# Altium schematic sheet EnviroNode.SchDoc
size Tabloid
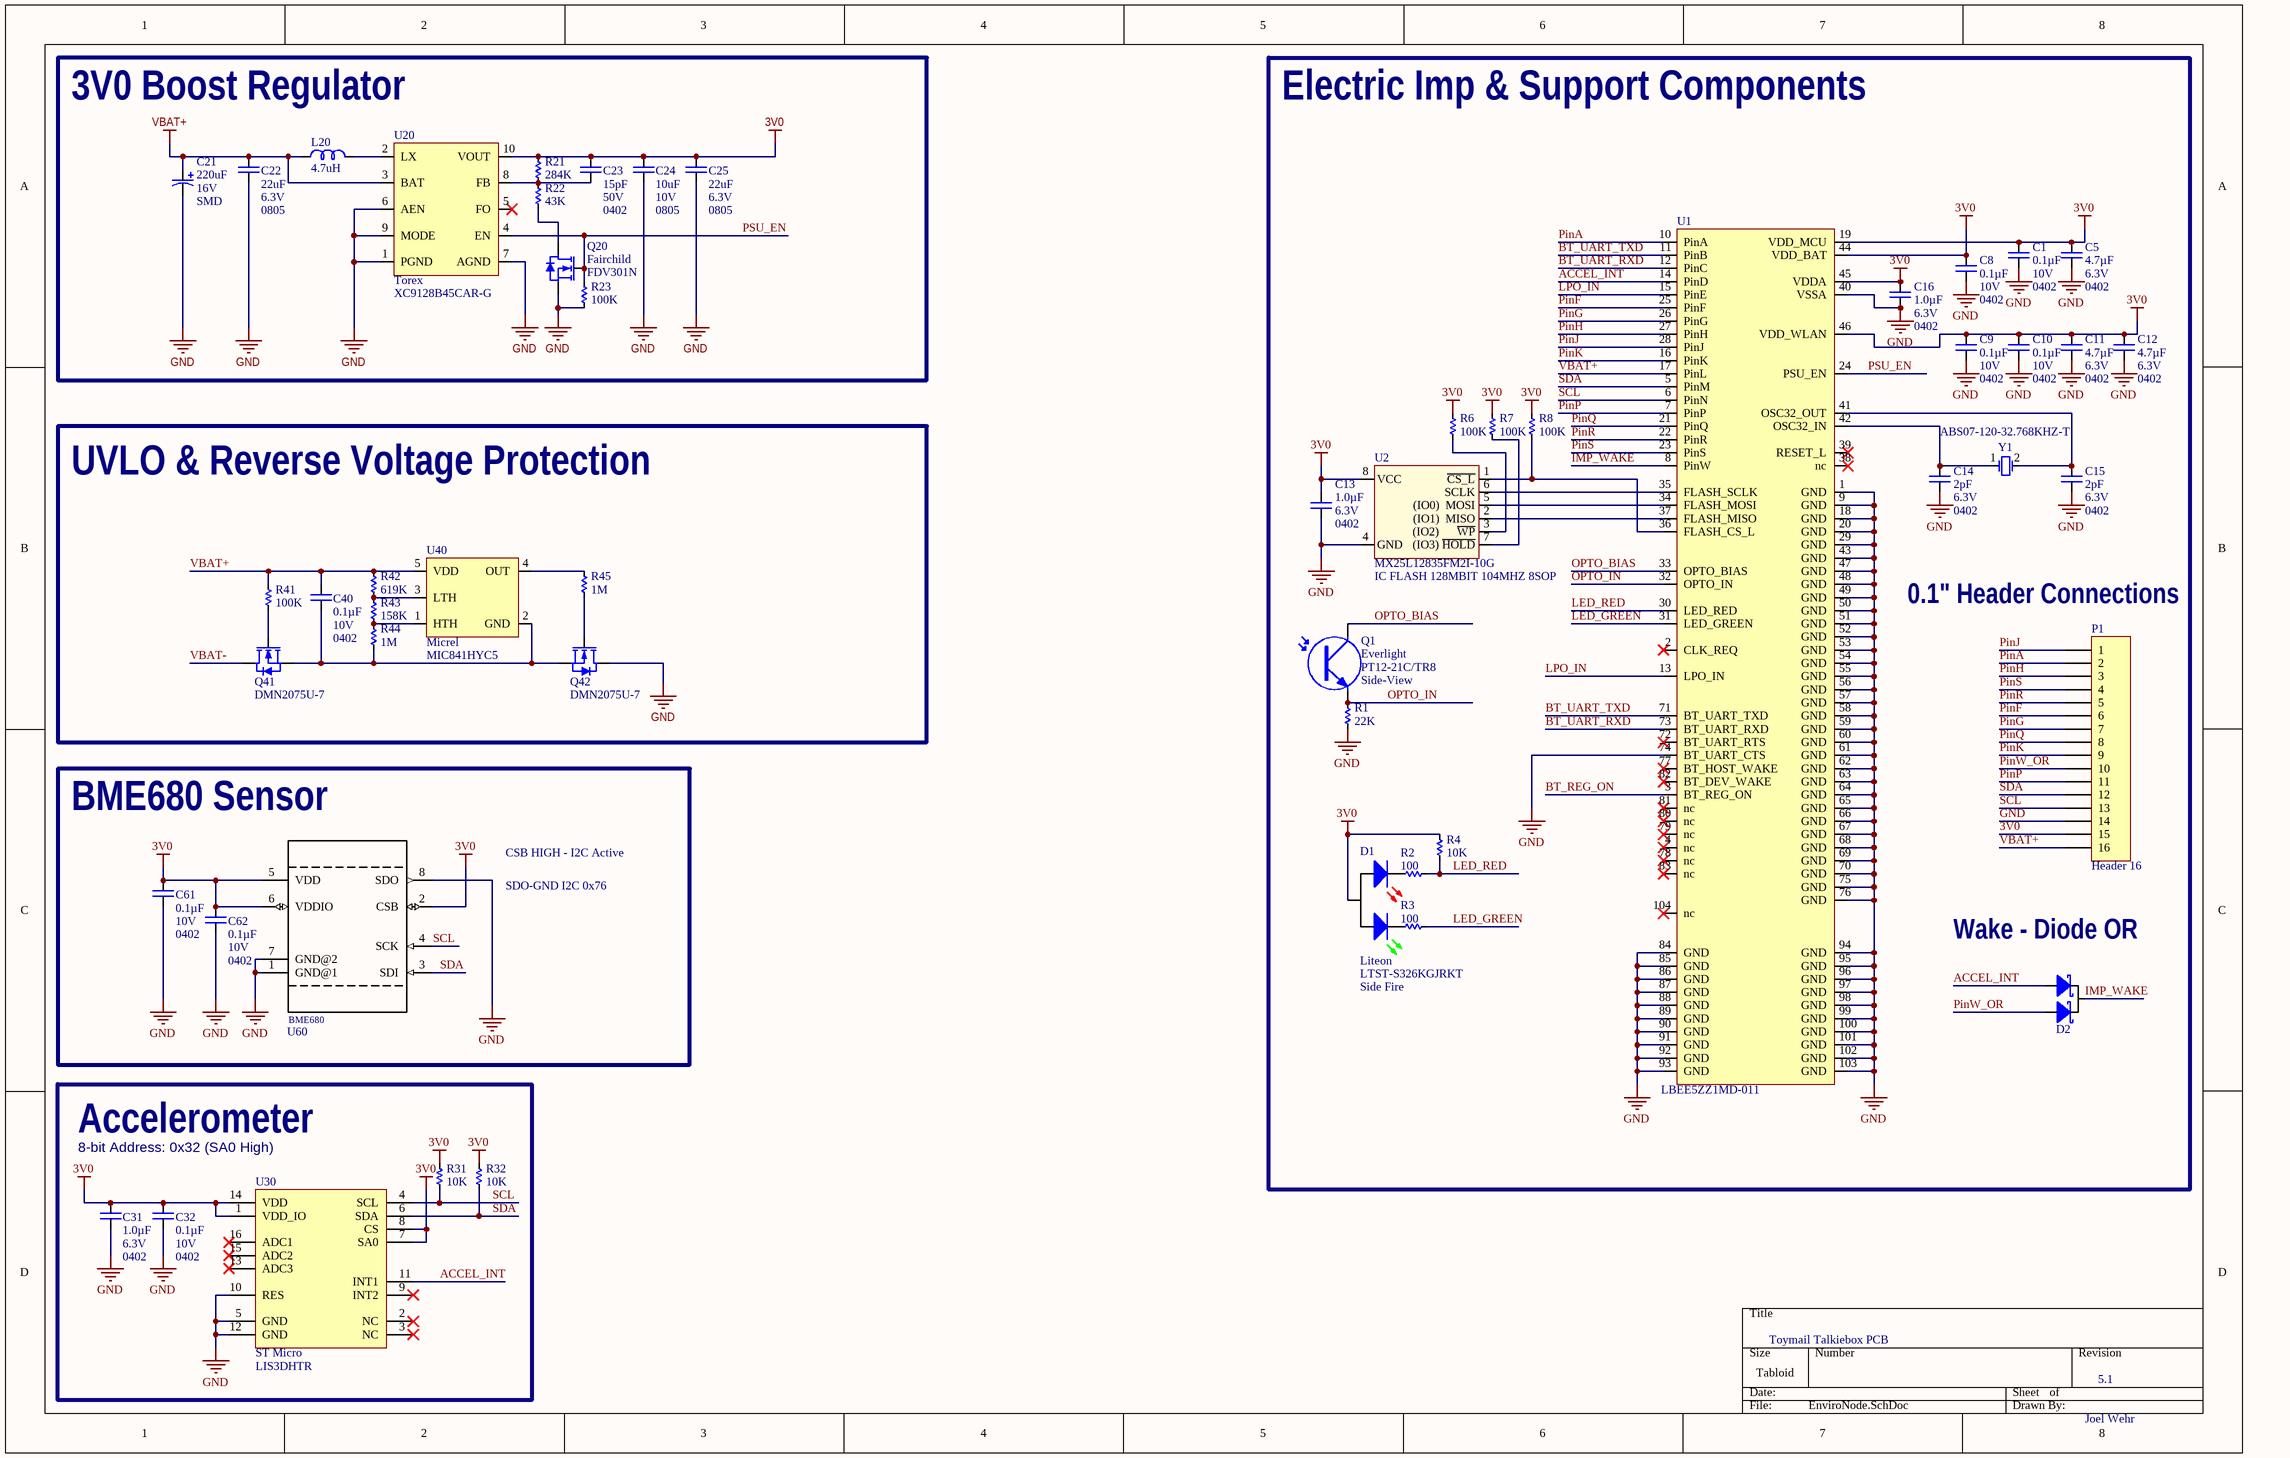
[diagram p0: EnviroNode.SchDoc]

## Parts
C1  value 0.1µF  Voltage: 10V  Package: 0402  [CAPC1005X07N]  (hidden comment: CAP CER 0.1UF 10V X5R 0402)
C5  value 4.7µF  Voltage: 6.3V  Package: 0402  [CAPC1005X07N]  (hidden comment: CAP CER 4.7UF 6.3V X5R 0402)
C8  value 0.1µF  Voltage: 10V  Package: 0402  [CAPC1005X07N]  (hidden comment: CAP CER 0.1UF 10V X5R 0402)
C9  value 0.1µF  Voltage: 10V  Package: 0402  [CAPC1005X07N]  (hidden comment: CAP CER 0.1UF 10V X5R 0402)
C10  value 0.1µF  Voltage: 10V  Package: 0402  [CAPC1005X07N]  (hidden comment: CAP CER 0.1UF 10V X5R 0402)
C11  value 4.7µF  Voltage: 6.3V  Package: 0402  [CAPC1005X07N]  (hidden comment: CAP CER 4.7UF 6.3V X5R 0402)
C12  value 4.7µF  Voltage: 6.3V  Package: 0402  [CAPC1005X07N]  (hidden comment: CAP CER 4.7UF 6.3V X5R 0402)
C13  value 1.0µF  Voltage: 6.3V  Package: 0402  [CAPC1005X07N]  (hidden comment: CAP CER 1.0UF 6.3V X7R 0402)
C14  value 2pF  Voltage: 6.3V  Package: 0402  [CAPC1005X07N]  (hidden comment: CAP CER 2pF 6.3V X7R 0402)
C15  value 2pF  Voltage: 6.3V  Package: 0402  [CAPC1005X07N]  (hidden comment: CAP CER 2pF 6.3V X7R 0402)
C16  value 1.0µF  Voltage: 6.3V  Package: 0402  [CAPC1005X07N]  (hidden comment: CAP CER 1.0UF 6.3V X7R 0402)
C21  value 220uF  Voltage: 16V  Package: SMD  [UWT1C221MCL1GS]  (hidden comment: Polarized Capacitor)
C22  value 22uF  Voltage: 6.3V  Package: 0805  [CAPC2012X14N]  (hidden comment: CAP CER 22UF 6.3V X5R 0805)
C23  value 15pF  Voltage: 50V  Package: 0402  [CAPC1005X07N]  (hidden comment: CAP CER 15PF 50V C0G/NP0 0402)
C24  value 10uF  Voltage: 10V  Package: 0805  [CAPC2012X14N]  (hidden comment: CAP CER 10UF 10V X5R 0805)
C25  value 22uF  Voltage: 6.3V  Package: 0805  [CAPC2012X14N]  (hidden comment: CAP CER 22UF 6.3V X5R 0805)
C31  value 1.0µF  Voltage: 6.3V  Package: 0402  [CAPC1005X07N]  (hidden comment: CAP CER 1.0UF 6.3V X7R 0402)
C32  value 0.1µF  Voltage: 10V  Package: 0402  [CAPC1005X07N]  (hidden comment: CAP CER 0.1UF 10V X5R 0402)
C40  value 0.1µF  Voltage: 10V  Package: 0402  [CAPC1005X07N]  (hidden comment: CAP CER 0.1UF 10V X5R 0402)
C61  value 0.1µF  Voltage: 10V  Package: 0402  [CAPC1005X07N]  (hidden comment: CAP CER 0.1UF 10V X5R 0402)
C62  value 0.1µF  Voltage: 10V  Package: 0402  [CAPC1005X07N]  (hidden comment: CAP CER 0.1UF 10V X5R 0402)
D1  Manufacturer: Liteon  Orientation: Side Fire  [LTST-S326KGJRKT]  (hidden comment: LED Red and Green)  (no BOM)
D2  Dual Schottky Diode  [SOT95P300X130-3N]  (value not drawn)
L20  value 4.7uH  [INDP6060X28N]  (hidden comment: NR6028T4R7M)
P1  Header 16  [HDR1X16]
Q1  Manufacturer: Everlight  Manufacturer Part Number: PT12-21C/TR8  Orientation: Side-View  [PT12-21C]  (hidden comment: PHOTOTRANSISTOR)
Q20  Manufacturer: Fairchild  Manufacturer Part Number: FDV301N  [SOT95P300X130-3N]  (hidden comment: N-Channel MOSFET)
Q41  N-Channel MOSFET  [SOT95P300X130-3N]  (value not drawn)
Q42  N-Channel MOSFET  [SOT95P300X130-3N]  (value not drawn)
R1  value 22K  [RESC1005X04N]  (hidden comment: RES SMD 22K OHM 1% 1/16W 0402)
R2  value 100  [RESC1005X04N]  (hidden comment: RES SMD 100 OHM 5% 1/16W 0402)
R3  value 100  [RESC1005X04N]  (hidden comment: RES SMD 100 OHM 5% 1/16W 0402)
R4  value 10K  [RESC1005X04N]  (hidden comment: RES SMD 10K OHM 1% 1/16W 0402)
R6  value 100K  [RESC1005X04N]  (hidden comment: RES SMD 100K OHM 5% 1/16W 0402)
R7  value 100K  [RESC1005X04N]  (hidden comment: RES SMD 100K OHM 5% 1/16W 0402)
R8  value 100K  [RESC1005X04N]  (hidden comment: RES SMD 100K OHM 5% 1/16W 0402)
R21  value 284K  [RESC1005X04N]  (hidden comment: RES SMD 220K OHM 1% 1/16W 0402)
R22  value 43K  [RESC1005X04N]  (hidden comment: RES SMD 43K OHM 1% 1/16W 0402)
R23  value 100K  [RESC1005X04N]  (hidden comment: RES SMD 100K OHM 5% 1/16W 0402)
R31  value 10K  [RESC1005X04N]  (hidden comment: RES SMD 10K OHM 1% 1/16W 0402)
R32  value 10K  [RESC1005X04N]  (hidden comment: RES SMD 10K OHM 1% 1/16W 0402)
R41  value 100K  [RESC1005X04N]  (hidden comment: RES SMD 100K OHM 5% 1/16W 0402)
R42  value 619K  [RESC1005X04N]  (hidden comment: RES SMD 1M OHM 1% 1/16W 0402)
R43  value 158K  [RESC1005X04N]  (hidden comment: RES SMD 1M OHM 1% 1/16W 0402)
R44  value 1M  [RESC1005X04N]  (hidden comment: RES SMD 1M OHM 1% 1/16W 0402)
R45  value 1M  [RESC1005X04N]  (hidden comment: RES SMD 1M OHM 1% 1/16W 0402)
U1  Manufacturer Part Number: LBEE5ZZ1MD-011  [LBEE5ZZ1MD]  (hidden comment: Murata Imp004m Module)
U2  IC FLASH 128MBIT 104MHZ 8SOP  Manufacturer Part Number: MX25L12835FM2I-10G  [SOP127P790X216-8N]
U20  Manufacturer: Torex  Manufacturer Part Number: XC9128B45CAR-G  [MSOP50P490X116-10N]  (hidden comment: XC9128)
U30  Manufacturer: ST Micro  [LGA50P300X300X100-16N-ST]  (hidden comment: LIS3DHTR)
U40  Manufacturer: Micrel  Manufacturer Part Number: MIC841HYC5  [SOT65P200X125-5N]  (hidden comment: MIC841)
U60  BME680  [BME680]  (value not drawn)
Y1  Manufacturer Part Number: ABS07-120-32.768KHZ-T  [XTAL_32X15X09-2N]  (hidden comment: XTAL_COMPACT)

## Blocks framed on the sheet
Electric Imp & Support Components: C1 C5 C8-C16 D1 D2 P1 Q1 R1-R4 R6-R8 U1 U2 Y1
Accelerometer: C31 C32 R31 R32 U30

## Nets
3V0: C1.2 C5.2 C8.2 C9.2 C10.2 C11.2 C12.2 C13.2 C16.2 C23.2 C24.2 C25.2 C31.2 C32.2 C61.2 C62.2 D1.A P1.15 R4.1 R6.1 R7.1 R8.1 R21.1 R31.1 R32.1 U1.19(VDD_MCU) U1.44(VDD_BAT) U1.45(VDDA) U1.46(VDD_WLAN) U2.8(VCC) U20.10(VOUT) U30.1(VDD_IO) U30.7(SA0) U30.8(CS) U30.14(VDD) U60.2(CSB) U60.5(VDD) U60.6(VDDIO)
GND: C1.1 C5.1 C8.1 C9.1 C10.1 C11.1 C12.1 C13.1 C14.1 C15.1 C16.1 C21.2 C22.1 C24.1 C25.1 C31.1 C32.1 C61.1 C62.1 P1.14 Q20.2(S) Q42.3(D) R1.2 R23.2 U1.1(GND) U1.9(GND) U1.18(GND) U1.20(GND) U1.29(GND) U1.40(VSSA) U1.43(GND) U1.47(GND) U1.48(GND) U1.49(GND) U1.50(GND) U1.51(GND) U1.52(GND) U1.53(GND) U1.54(GND) U1.55(GND) U1.56(GND) U1.57(GND) U1.58(GND) U1.59(GND) U1.60(GND) U1.61(GND) U1.62(GND) U1.63(GND) U1.64(GND) U1.65(GND) U1.66(GND) U1.67(GND) U1.68(GND) U1.69(GND) U1.70(GND) U1.74(BT_UART_CTS) U1.75(GND) U1.76(GND) U1.84(GND) U1.85(GND) U1.86(GND) U1.87(GND) U1.88(GND) U1.89(GND) U1.90(GND) U1.91(GND) U1.92(GND) U1.93(GND) U1.94(GND) U1.95(GND) U1.96(GND) U1.97(GND) U1.98(GND) U1.99(GND) U1.100(GND) U1.101(GND) U1.102(GND) U1.103(GND) U2.4(GND) U20.1(PGND) U20.6(AEN) U20.7(AGND) U20.9(MODE) U30.5(GND) U30.10(RES) U30.12(GND) U60.1(GND@1) U60.7(GND@2) U60.8(SDO)
VBAT+: C21.1 C22.2 C40.2 L20.1 P1.16 R41.1 R42.1 U1.17(PinL) U20.3(BAT) U40.5(VDD)
ACCEL_INT: D2.1 U1.14(PinD) U30.11(INT1)
BT_REG_ON: U1.3(BT_REG_ON)
BT_UART_RXD: U1.12(PinC) U1.73(BT_UART_RXD)
BT_UART_TXD: U1.11(PinB) U1.71(BT_UART_TXD)
IMP_WAKE: D2.3 U1.8(PinW)
LED_GREEN: R3.2 U1.31(LED_GREEN)
LED_RED: R2.2 R4.2 U1.30(LED_RED)
LPO_IN: U1.13(LPO_IN) U1.15(PinE)
OPTO_BIAS: Q1.C U1.33(OPTO_BIAS)
OPTO_IN: Q1.E R1.1 U1.32(OPTO_IN)
PinA: P1.2 U1.10(PinA)
PinF: P1.6 U1.25(PinF)
PinG: P1.7 U1.26(PinG)
PinH: P1.3 U1.27(PinH)
PinJ: P1.1 U1.28(PinJ)
PinK: P1.9 U1.16(PinK)
PinP: P1.11 U1.7(PinP)
PinQ: P1.8 U1.21(PinQ)
PinR: P1.5 U1.22(PinR)
PinS: P1.4 U1.23(PinS)
PinW_OR: D2.2 P1.10
PSU_EN: Q20.1(G) R23.1 U1.24(PSU_EN) U20.4(EN)
SCL: P1.13 R31.2 U1.6(PinN) U30.4(SCL) U60.4(SCK)
SDA: P1.12 R32.2 U1.5(PinM) U30.6(SDA) U60.3(SDI)
VBAT-: Q41.3(D)
NetC14_2: C14.2 U1.42(OSC32_IN) Y1.1(OSC1)
NetC15_2: C15.2 U1.41(OSC32_OUT) Y1.2(OSC2)
NetC23_1: C23.1 R21.2 R22.1 U20.8(FB)
NetC40_1: C40.1 Q41.2(S) Q42.2(S) R44.2 U40.2(GND)
NetD1_KG: D1.KG R3.1
NetD1_KR: D1.KR R2.1
NetL20_2: L20.2 U20.2(LX)
NetQ20_3: Q20.3(D) R22.2
NetQ41_1: Q41.1(G) R41.2
NetQ42_1: Q42.1(G) R45.2
NetR6_2: R6.2 U2.3((IO2)______~{WP})
NetR7_2: R7.2 U2.7((IO3)_~{HOLD})
NetR8_2: R8.2 U1.36(FLASH_CS_L) U2.1(~{CS_L})
NetR42_2: R42.2 R43.1 U40.3(LTH)
NetR43_2: R43.2 R44.1 U40.1(HTH)
NetR45_1: R45.1 U40.4(OUT)
NetU1_34: U1.34(FLASH_MOSI) U2.5((IO0)__MOSI)
NetU1_35: U1.35(FLASH_SCLK) U2.6(SCLK)
NetU1_37: U1.37(FLASH_MISO) U2.2((IO1)__MISO)

Not connected (* = marked no-connect by the designer): U1 2(CLK_REQ)* 4(nc)* 38(nc)* 39(RESET_L)* 72(BT_UART_RTS)* 77(BT_HOST_WAKE)* 78(nc)* 79(nc)* 80(nc)* 81(nc)* 82(BT_DEV_WAKE)* 83(nc)* 104(nc)*; U20 5(FO)*; U30 2(NC)* 3(NC)* 9(INT2)* 13(ADC3)* 15(ADC2)* 16(ADC1)*

## Notes on the sheet
- 3V0 Boost Regulator
- UVLO & Reverse Voltage Protection
- (near P1) 0.1" Header Connections
- BME680 Sensor
- CSB HIGH - I2C Active
- SDO-GND I2C 0x76
- (near D2) Wake - Diode OR
- 8-bit Address: 0x32 (SA0 High)
- Toymail Talkiebox PCB
- 5.1
- Joel Wehr

## Library data of the parts
C1 C8-C10 C32 C40 C61 C62 = CAP CER 0.1UF 10V X5R 0402: Manufacturer: Taiyo Yuden; Manufacturer Part Number: LMK105BJ104KV-F; Tolerance: 10%; Dielectric: X5R; Supplier 1: Digi-Key; Supplier Part Number 1: 587-1227-2-ND
C5 C11 C12 = CAP CER 4.7UF 6.3V X5R 0402: Manufacturer: Samsung Electro-Mechanics; Tolerance: 10%; Dielectric: X5R; Supplier 1: Digi-Key
C13 C16 C31 = CAP CER 1.0UF 6.3V X7R 0402: Tolerance: 10%; Dielectric: X5R; Supplier 1: Digi-Key
C14 C15 = CAP CER 2pF 6.3V X7R 0402: Tolerance: 10%; Dielectric: X5R; Supplier 1: Digi-Key
C21 = CAP,ALUM POLYMER,220uF,20%,16V,SMD: Part Number: CAPP00124; Manufacturer: Nichicon; Tolerance: 20%; Dielectric: Alum; Manufacturer Part Number: UWT1C221MCL1GS; Supplier 1: Digi-Key; Supplier Part Number 1: 493-2179-1-ND; Supplier Price 1: 0.1235; Supplier 2: Digi-Key; Supplier Part Number 2: 493-2179-2-ND; Supplier Price 2: 0.0882
C22 C25 = CAP CER 22UF 6.3V X5R 0805: Part Number: CAPC00039; Manufacturer: KEMET; Manufacturer Part Number: C0805C226M9PACTU; Tolerance: 20%; Dielectric: X5R; Supplier 1: Digi-Key; Supplier Part Number 1: 399-4696-1-ND
C23 = CAP CER 13PF 50V C0G/NP0 0402: Manufacturer: Murata Electronics North America; Manufacturer Part Number: GRM1555C1H130JA01D; Tolerance: 5%; Dielectric: C0G/NP0; Supplier 1: Digi-Key; Supplier Part Number 1: 490-5925-2-ND
C24 = CAP CER 10UF 10V X5R 0805: Part Number: CAPC00039; Manufacturer: TDK; Manufacturer Part Number: LMK212BJ106KG-T; Tolerance: 20%; Dielectric: X5R; Supplier 1: Digi-Key; Supplier Part Number 1: 587-1300-1-ND
D1 = LED_REDGREEN_CA: LED, Dual, Side-view, Red-Green,2V, Common Anode, SMT; Part Number: LED00016; Color: Red/Green; Millicandela Rating: 45mcd, 35mcd; Voltage - Forward (Vf) Typ: 2.0V, 2.0V; Current - Test: 20mA; Wavelength - Dominant: 631nm, 571nm; Wavelength - Peak: 639nm, 574nm; Viewing Angle: 130°; Lens Type: Clear; BOMOPTION: DNS; Package: SMT; Supplier 1: Digi-Key; Supplier Part Number 1: 160-2033-1-ND; Supplier Price 1: 0.1206; ComponentLink1URL: http://www.digikey.com/product-detail/en/LTST-S326KGJRKT/160-2033-1-ND/3711390; Manufacturer Part Number: LTST-S326KGJRKT
D2 = BAT54C: DIODE, Schottky, 200mA, 30V, Dual, Common Cathode, SOT23; Part Number: SCHOTTKY00009; Manufacturer: Fairchild; Diode Type: Schottky, Dual; Voltage - Forward (Vf) (Max) @ If: 800mV @ 100mA; Voltage - DC Reverse (Vr) (Max): 30V; Current - Average Rectified (Io): 200mA; Package: SOT-23; Manufacturer Part Number: BAT54C; Supplier 1: Digi-key; Supplier Part Number 1: BAT54CFSCT-ND; Supplier Price 1: 0.03986; ComponentLink1URL: http://www.digikey.com/product-detail/en/BAT54C/BAT54CFSCT-ND/458929
L20 = NR6028T4R7M: FIXED IND 4.7UH 3A 40.3 MOHM SMD; Part Number: IND00007; Manufacturer: Taiyo Yuden; Current: 2.7A; Tolerance: 20%; DC Resistance (DCR): 403 mOhm; Manufacturer Part Number: NR6028T4R7M; Package: 6028; Current - Temperature Rise: 2.7A; Supplier 1: Digi-Key; Supplier Part Number 1: 587-2100-1-ND; Supplier Price 1: 0.15525; ComponentLink1URL: http://www.yuden.co.jp/productdata/catalog/en/wound04_e.pdf; Stock Date: 3/6/2013; Stock Quantity: 31
P1 = Header 16: Header, 16-Pin; LatestRevisionDate: 17-Jul-2002; LatestRevisionNote: Re-released for DXP Platform.; Publisher: Altium Limited
Q1 = PHOTOTRANSISTOR: Phototrans, Clear, Side-view, 940nm, 0.4V, 1.14mA, SMT; Part Number: PHOTO00004; Package: SMT; Lens Type: Clear; Supplier 1: Digi-Key; Supplier Part Number 1: 1080-1378-1-ND; Supplier Price 1: 0.7825; ComponentLink1URL: http://www.digikey.com/product-detail/en/PT12-21C%2FTR8/1080-1378-1-ND/2676112
Q20 = DMN2075U-7: NFET; Part Number: NFET00004; Package: SOT23
Q41 Q42 = DMN2075U-7: NFET, 20V, 4.2A, SOT23; Part Number: NFET00004; Manufacturer: Diodes Incorporated; Rds On (Max) @ Id, Vgs: 45 mOhm @ 3.1A, 2.5V; Vgs(th) (Max) @ Id: 1.0V @ 250uA; Power - Max: 800mW; Drain to Source Voltage (Vdss): 20V; Current - Continuous Drain (Id) @ 25° C: 4.2A; Package: SOT23; Supplier 1: Digi-Key; Supplier Part Number 1: DMN2075U-7DICT-ND; Supplier Price 1: 0.08295; Stock Quantity: 41; Stock Date: 3/5/2013; ComponentLink1URL: http://www.diodes.com/datasheets/ds31837.pdf; Manufacturer Part Number: DMN2075U-7
R1 R21 R22 = RES SMD 22K OHM 1% 1/16W 0402: Manufacturer: Samsung; Power: 0.063W; Supplier 1: Digi-Key; Supplier 2: Digi-Key; Package: 0402; Tolerance: 1%
R2 R3 = RES SMD 100 OHM 5% 1/16W 0402: Power: 0.063W; Package: 0402; Tolerance: 5%
R4 R31 R32 = RES SMD 10K OHM 1% 1/16W 0402: Power: 0.063W; Package: 0402; Tolerance: 1%
R6-R8 R23 R41 = RES SMD 100K OHM 5% 1/16W 0402: Part Number: RES00001; Manufacturer: Samsung; Manufacturer Part Number: RC1005J104CS; Power: 0.063W; Manufacturer 2: ROHM; Manufacturer Part Number 2: MCR01MRTJ104; Supplier 1: Digi-Key; Supplier Part Number 1: 1276-4424-1-ND; Supplier Price 1: 0.0023; Supplier 2: Digi-Key; Supplier Part Number 2: HM100KCECT-ND; Supplier Price 2: 0.00233; Stock Quantity: 2100; Stock Date: 4/5/2013; Package: 0402; Tolerance: 5%
R42-R45 = RES SMD 1M OHM 1% 1/16W 0402: Manufacturer: Samsung; Power: 0.063W; Supplier 1: Digi-Key; Supplier 2: Digi-Key; Package: 0402; Tolerance: 1%
U1 = LBEE5ZZ1MD: Manufacturer: Murata Electronics North America; Supplier 1 Part Number 1: IMP004M-1-ND; Supplier 1 Part Number 2: IMP004M-2-ND; Supplier 1: Digi-Key; Supplier 2: Digi-Key; Supplier 3: Digi-Key; Supplier Part Number 1: IMP004M-6-ND; Supplier Part Number 2: IMP004M-1-ND; Supplier Part Number 3: IMP004M-2-ND
U2 = IC FLASH 128MBIT 104MHZ 8SOP: Manufacturer: Macronix; Supplier 1: Digi-Key; ComponentLink1URL: https://www.digikey.com/products/en?keywords=MX25L12835FM2I-10G; Supplier Part Number: 1092-1197-ND
U20 = XC9128: IC, DC/DC boost,Adjustable, 6 VIN, 500mA, MSOP10; Part Number: IC00026; Manufacturer 2: Torex; Manufacturer Part Number 2: XC9128D45CAR-G; Supplier 1: Digi-Key; Supplier Part Number 1: 893-1104-1-ND; Supplier Price 1: 0.882; Stock Quantity: 8; Stock Date: 2/27/2013; ComponentLink1URL: http://www.torex.co.jp/english/products/dcdc_converters/data/XC9128~29.pdf
U30 = LIS3DHTR: IC, Accelerometer, 3-Axis, Low Power, 16-bit, LGA16; Part Number: IC00038; Supplier 1: Digi-Key; Supplier Part Number 1: 497-10613-1-ND; Supplier Price 1: 1.09366; Supplier 2: Mouser; Supplier Part Number 2: 511-LIS3DHTR; Supplier Price 2: 1.06; ComponentLink1URL: http://www.st.com/internet/com/TECHNICAL_RESOURCES/TECHNICAL_LITERATURE/DATASHEET/CD00274221.pdf; Stock Date: 3/5/2013; Stock Quantity: 15; Manufacturer Part Number: LIS3DHTR
U40 = MIC841: IC, Comparator with Reference and Programmable Hysteresis, SOT-353; Part Number: IC00032; Supplier 1: Digi-Key; Supplier Part Number 1: 576-2923-1-ND; Supplier Price 1: 0.504; ComponentLink1URL: http://www.micrel.com/_PDF/mic841.pdf; Stock Date: 2/27/2013; Stock Quantity: 1
U60 = BME680: Integrated Environmental Unit; MF: Bosch; SnapEDA_Link: https://www.snapeda.com/symbols-footprints/BME680/Bosch%20Sensortec/view-part/?ref=snap; Package: LGA-8 Bosch Tools; MP: BME680; Price: 9.31 USD; Availability: Good; Value: *
Y1 = XTAL_COMPACT: XTAL, 32.768kHz, 20ppm, 6pF, 60K Ohm, 3215; Manufacturer: Abracon; Part Number: XTAL00004; Operating Mode: Fundamental; Package: 2-SMD; Frequency Tolerance: 20ppm; Load Capacitance: 6pF; Supplier 1: Digi-Key; Supplier Part Number 1: 535-11937-1-ND; Supplier Price 1: 0.42502; Stock Quantity: 48; Stock Date: 4/1/2013; ComponentLink1URL: http://www.digikey.com/product-detail/en/ABS07-120-32.768KHZ-T/535-11937-1-ND/3724046; Frequency: 32.768kHz